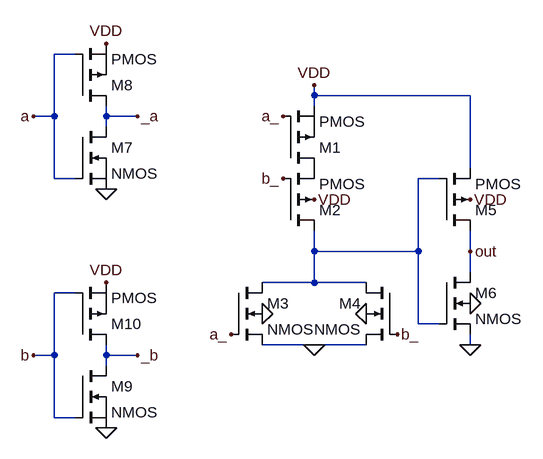
[diagram p0: schematic Draft1.asc]
Draft1.asc, the LTspice schematic file:
Version 4
SHEET 1 880 680
WIRE -240 -160 -272 -160
WIRE 128 -96 128 -112
WIRE 368 -96 128 -96
WIRE 128 -80 128 -96
WIRE -272 -64 -272 -160
WIRE -272 -64 -304 -64
WIRE -192 -64 -192 -80
WIRE -144 -64 -192 -64
WIRE -192 -48 -192 -64
WIRE 368 16 368 -96
WIRE -272 32 -272 -64
WIRE -240 32 -272 32
WIRE 320 32 288 32
WIRE 128 144 128 112
WIRE 288 144 288 32
WIRE 288 144 128 144
WIRE 368 144 368 112
WIRE 368 176 368 144
WIRE 128 192 128 144
WIRE 128 192 48 192
WIRE 208 192 128 192
WIRE -240 208 -272 208
WIRE 288 256 288 144
WIRE 320 256 288 256
WIRE 128 288 48 288
WIRE 208 288 128 288
WIRE 368 288 368 272
WIRE -272 304 -272 208
WIRE -272 304 -304 304
WIRE -192 304 -192 288
WIRE -144 304 -192 304
WIRE -192 320 -192 304
WIRE -272 400 -272 304
WIRE -240 400 -272 400
FLAG 368 144 out
FLAG 80 -64 a_
FLAG 0 272 a_
FLAG 80 32 b_
FLAG 256 272 b_
FLAG 48 240 0
FLAG 208 240 0
FLAG 128 64 VDD
FLAG 128 -112 VDD
FLAG 128 288 0
FLAG 368 288 0
FLAG 368 224 0
FLAG 368 64 VDD
FLAG -192 48 0
FLAG -192 416 0
FLAG -304 -64 a
FLAG -304 304 b
FLAG -192 -176 VDD
FLAG -192 192 VDD
FLAG -144 304 _b
FLAG -144 -64 _a
SYMBOL pmos 80 16 M180
SYMATTR InstName M1
SYMBOL nmos4 0 192 R0
SYMATTR InstName M3
SYMBOL nmos4 256 192 M0
SYMATTR InstName M4
SYMBOL pmos4 80 112 M180
SYMATTR InstName M2
SYMBOL pmos4 320 112 M180
SYMATTR InstName M5
SYMBOL nmos4 320 176 R0
SYMATTR InstName M6
SYMBOL nmos -240 -48 R0
SYMATTR InstName M7
SYMBOL pmos -240 -80 M180
SYMATTR InstName M8
SYMBOL nmos -240 320 R0
SYMATTR InstName M9
SYMBOL pmos -240 288 M180
SYMATTR InstName M10

The netlist it stands for:
* Draft1.asc
M1 P001 a_ VDD VDD PMOS
M3 N001 a_ 0 0 NMOS
M4 N001 b_ 0 0 NMOS
M2 N001 b_ P001 VDD PMOS
M5 out N001 VDD VDD PMOS
M6 out N001 0 0 NMOS
M7 _a a 0 0 NMOS
M8 _a a VDD VDD PMOS
M9 _b b 0 0 NMOS
M10 _b b VDD VDD PMOS
.model NMOS NMOS
.model PMOS PMOS
.lib standard.mos
.backanno
.end